# EAGLE board Rocket32_TRASIO_fixed (EAGLE 9.6.2)
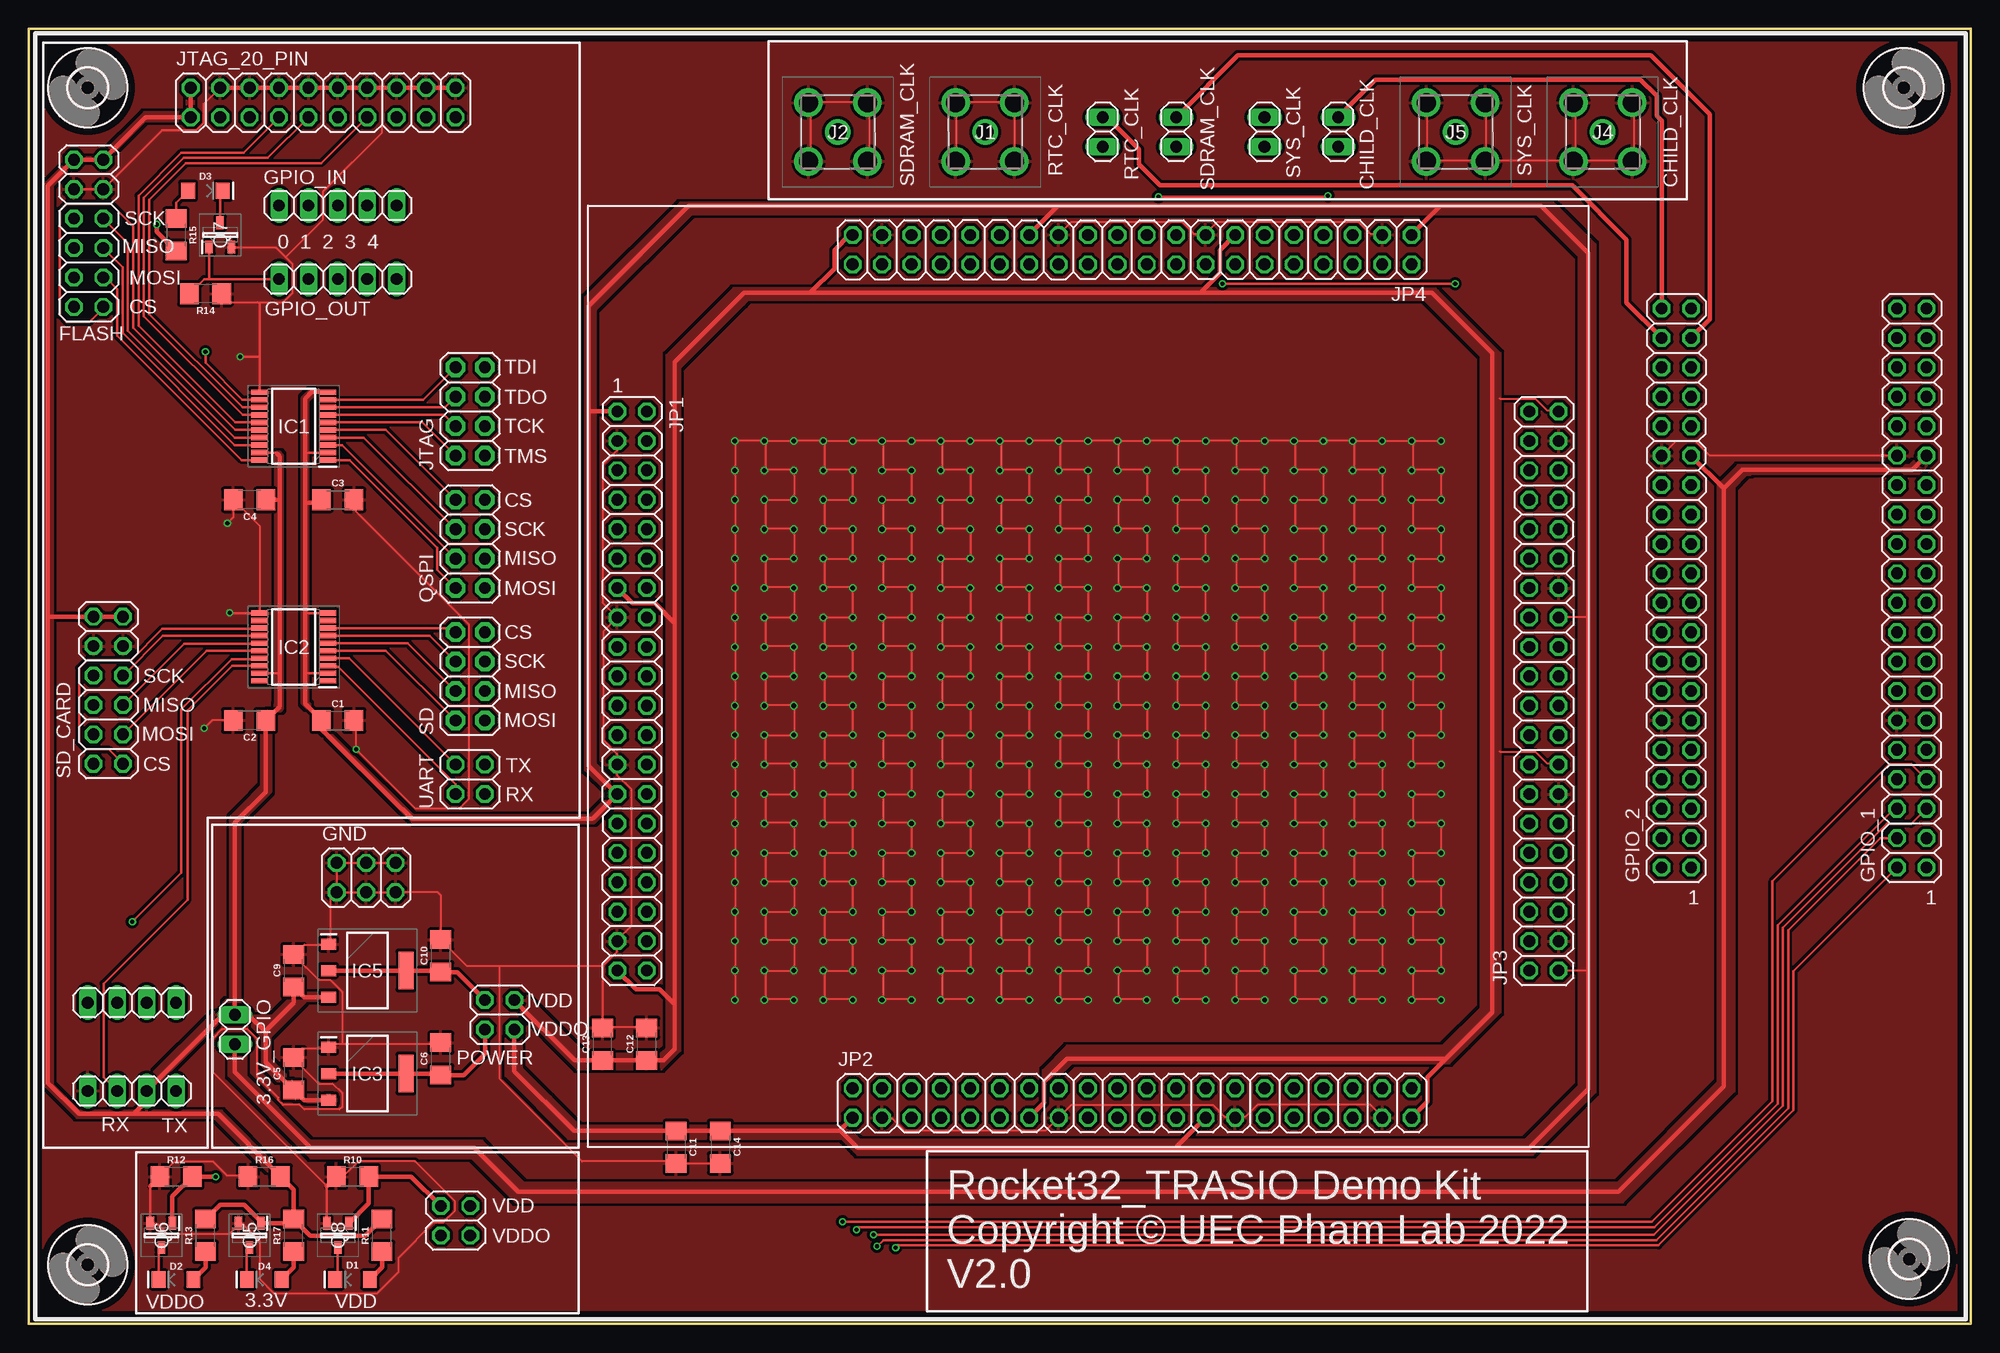
[diagram p2: board, top side]
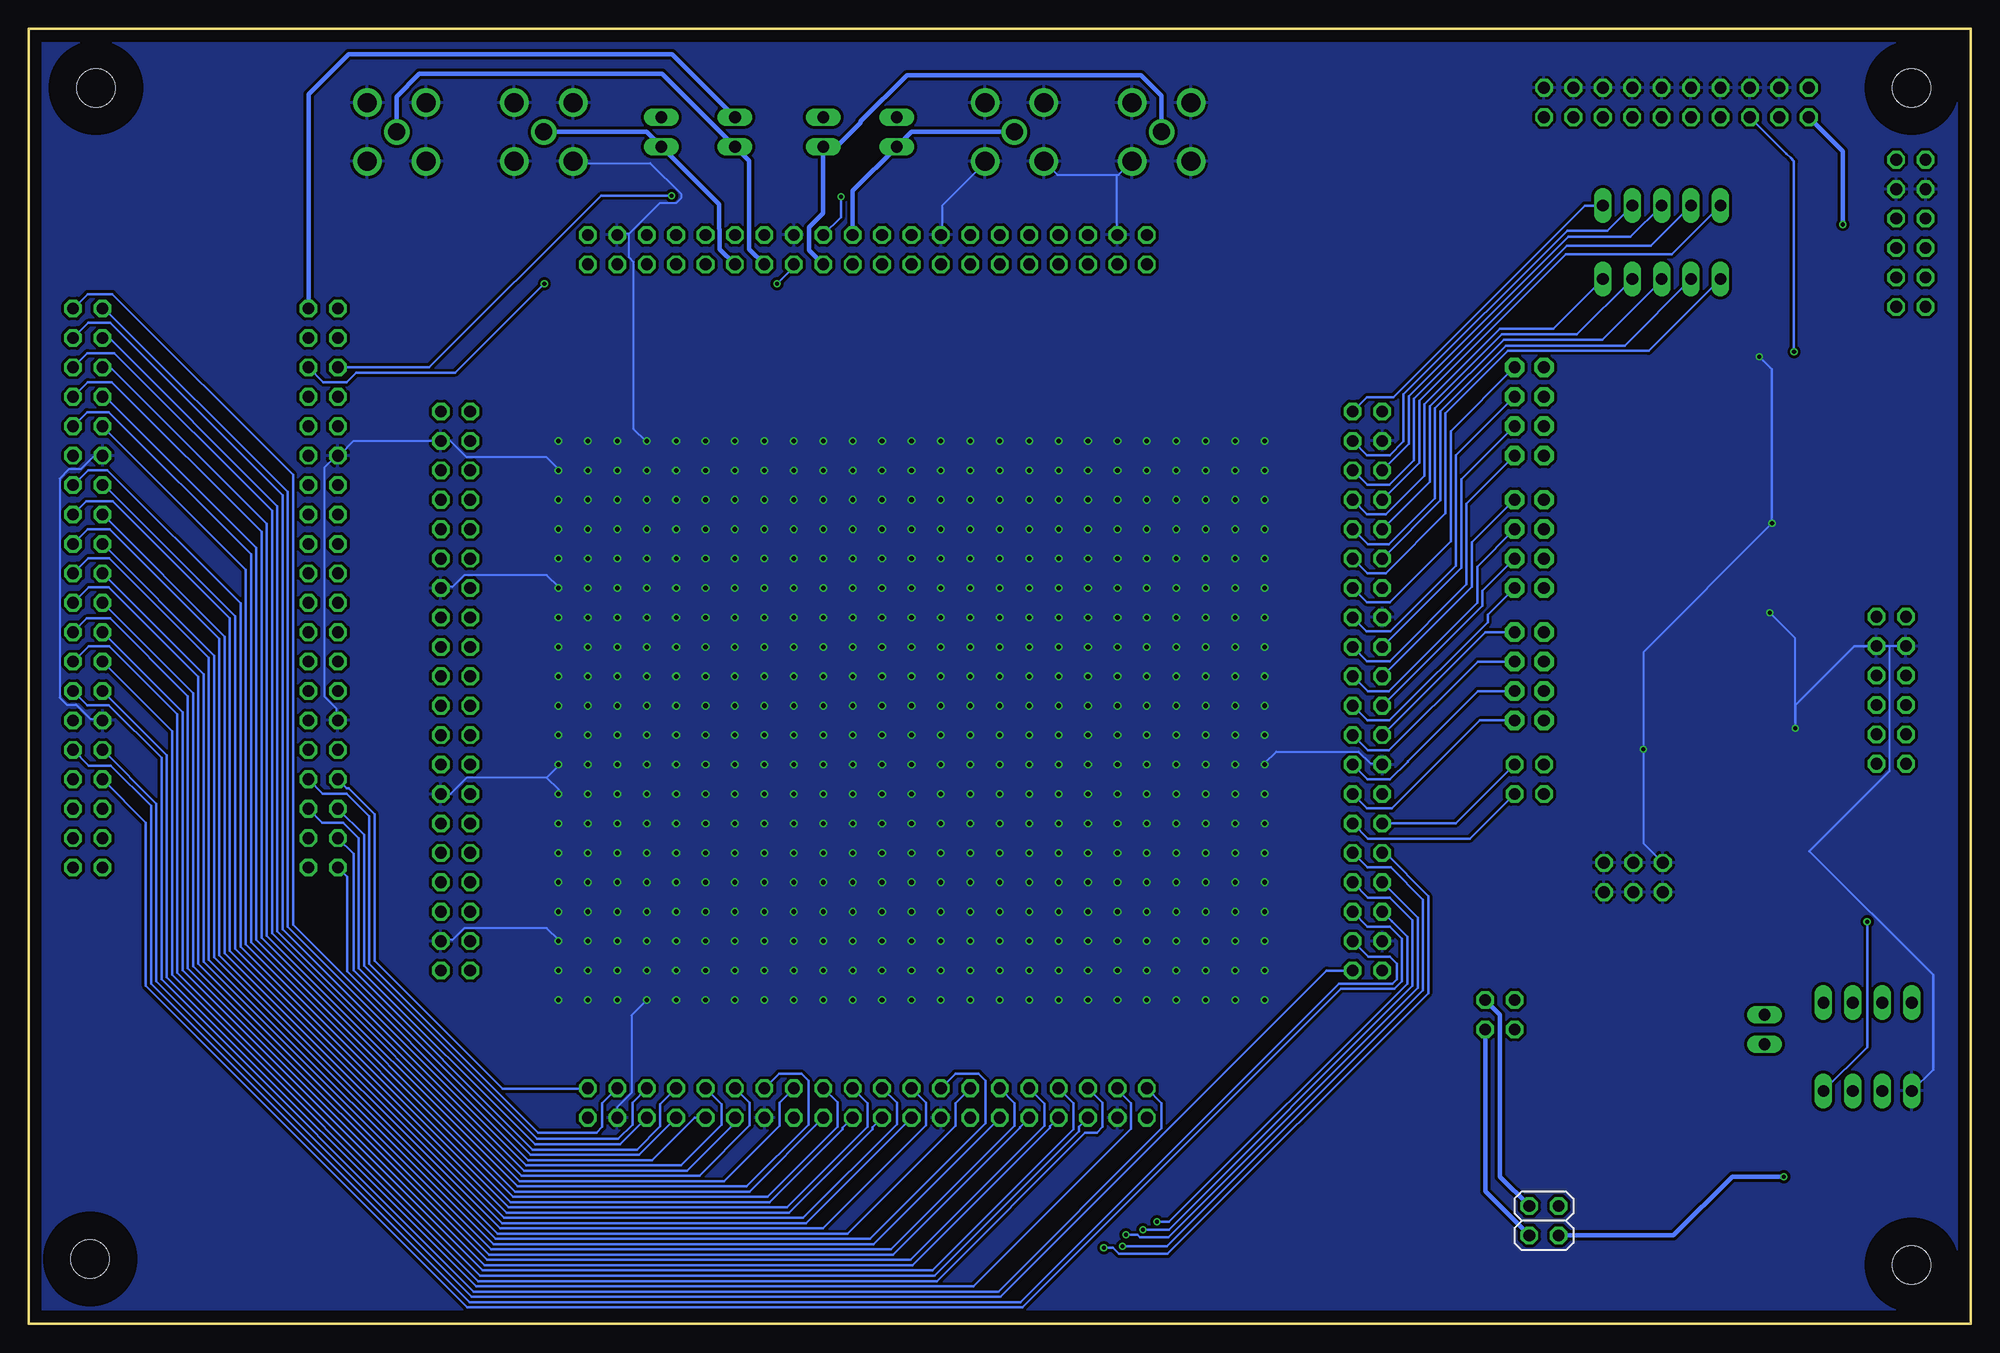
[diagram p3: board, bottom side, seen from below]

Size 167.64 x 111.76 mm. Coordinates in mm from the lower left corner, seen from the top.
Outline: 167.64,111.76 0,111.76 0,0 167.64,0 167.64,111.76
Copper layers (1*16): Top 0.035mm / dielectric 1.5mm / Bottom 0.035mm
Design rules "default *": minimum track width 6mil, minimum drill 0.35mm, track to track 10mil, track to pad 10mil, pad to pad 6mil, via to via 10mil, smd to smd 10mil, copper to edge 40mil, drill to drill 6mil, minimum pad ring 0.13mm, minimum via ring 0.13mm, stop-mask expansion 4mil, vias tented up to drill 0mil, thermal gap 10mil

## Footprints (pad centres in the part's own frame; a part is rotated, then mirrored left to right if it is on the bottom)
1X02 = drill 1.016 long: 1 -1.27,0; 2 1.27,0
1206 = smd 1.6 x 1.8: 1 -1.4,0; 2 1.4,0
LED-1206 = smd 1.2 x 1.4: A -1.5,0; C 1.5,0
2X06 = drill 1.016 octagon: 1 -6.35,-1.27; 2 -6.35,1.27; 3 -3.81,-1.27; 4 -3.81,1.27; 5 -1.27,-1.27; 6 -1.27,1.27; 7 1.27,-1.27; 8 1.27,1.27; 9 3.81,-1.27; 10 3.81,1.27; 11 6.35,-1.27; 12 6.35,1.27
2X03 = drill 1.016 octagon: 1 -2.54,-1.27; 2 -2.54,1.27; 3 0,-1.27; 4 0,1.27; 5 2.54,-1.27; 6 2.54,1.27
2X20 = drill 1.016 octagon: 1 -24.13,-1.27; 2 -24.13,1.27; 3 -21.59,-1.27; 4 -21.59,1.27; 5 -19.05,-1.27; 6 -19.05,1.27; 7 -16.51,-1.27; 8 -16.51,1.27; 9 -13.97,-1.27; 10 -13.97,1.27; 11 -11.43,-1.27; 12 -11.43,1.27; 13 -8.89,-1.27; 14 -8.89,1.27; 15 -6.35,-1.27; 16 -6.35,1.27; 17 -3.81,-1.27; 18 -3.81,1.27; 19 -1.27,-1.27; 20 -1.27,1.27; 21 1.27,-1.27; 22 1.27,1.27; 23 3.81,-1.27; 24 3.81,1.27; 25 6.35,-1.27; 26 6.35,1.27; 27 8.89,-1.27; 28 8.89,1.27; 29 11.43,-1.27; 30 11.43,1.27; 31 13.97,-1.27; 32 13.97,1.27; 33 16.51,-1.27; 34 16.51,1.27; 35 19.05,-1.27; 36 19.05,1.27; 37 21.59,-1.27; 38 21.59,1.27; 39 24.13,-1.27; 40 24.13,1.27
1X05 = drill 1.016 long: 1 -5.08,0; 2 -2.54,0; 3 0,0; 4 2.54,0; 5 5.08,0
3,3 = hole 3.3: 0,0
SOP65P640X120-20N = smd 1.475 x 0.45: 1 -2.938,2.925; 2 -2.938,2.275; 3 -2.938,1.625; 4 -2.938,0.975; 5 -2.938,0.325; 6 -2.938,-0.325; 7 -2.938,-0.975; 8 -2.938,-1.625; 9 -2.938,-2.275; 10 -2.938,-2.925; 11 2.938,-2.925; 12 2.938,-2.275; 13 2.938,-1.625; 14 2.938,-0.975; 15 2.938,-0.325; 16 2.938,0.325; 17 2.938,0.975; 18 2.938,1.625; 19 2.938,2.275; 20 2.938,2.925
SOT229P700X180-4N = smd 1.3 x 0.95: 1 -3.35,2.29; 2 -3.35,0; 3 -3.35,-2.29 | smd 1.3 x 3.25: 4 3.35,0
29856004 = drill 1.64 pad 2.46: 1 0,0; 2 5.08,0; 3 5.08,5.08; 4 0,5.08 | drill 1.47 pad 2.205: 5 2.54,2.54
2X04 = drill 1.016 pad 1.676 octagon: 1 -3.81,-1.27; 2 -3.81,1.27; 3 -1.27,-1.27; 4 -1.27,1.27; 5 1.27,-1.27; 6 1.27,1.27; 7 3.81,-1.27; 8 3.81,1.27
2X10 = drill 1.016 octagon: 1 -11.43,-1.27; 2 -11.43,1.27; 3 -8.89,-1.27; 4 -8.89,1.27; 5 -6.35,-1.27; 6 -6.35,1.27; 7 -3.81,-1.27; 8 -3.81,1.27; 9 -1.27,-1.27; 10 -1.27,1.27; 11 1.27,-1.27; 12 1.27,1.27; 13 3.81,-1.27; 14 3.81,1.27; 15 6.35,-1.27; 16 6.35,1.27; 17 8.89,-1.27; 18 8.89,1.27; 19 11.43,-1.27; 20 11.43,1.27
2X02 = drill 1.016 octagon: 1 -1.27,-1.27; 2 -1.27,1.27; 3 1.27,-1.27; 4 1.27,1.27
SOT96P240X100-3N = smd 1.1 x 0.65: 1 -1.05,0.96; 2 -1.05,-0.96; 3 1.05,0
1X04 = drill 1.016 long: 1 -3.81,0; 2 -1.27,0; 3 1.27,0; 4 3.81,0

## Placement (x,y rotation side)
3.3V_GPIO  [1X02]  17.78,25.4 270 top
C1  0.1uF  [1206]  26.67,52.07 0 top
C2  0.1uF  [1206]  19.05,52.07 180 top
C3  0.1uF  [1206]  26.67,71.12 0 top
C4  0.1uF  [1206]  19.05,71.12 180 top
C5  100uF  [1206]  22.86,21.59 90 top
C6  22uF  [1206]  35.56,22.86 90 top
C9  100uF  [1206]  22.86,30.48 90 top
C10  22uF  [1206]  35.56,31.75 90 top
C11  0.1uF  [1206]  55.88,15.24 270 top
C12  0.1uF  [1206]  53.34,24.13 90 top
C13  10uF  [1206]  49.53,24.13 90 top
C14  10uF  [1206]  59.69,15.24 270 top
CHILD_CLK  [1X02]  113.03,102.87 270 top
D1  [LED-1206]  27.94,3.81 180 top
D2  [LED-1206]  12.7,3.81 180 top
D3  [LED-1206]  15.24,97.79 0 top
D4  [LED-1206]  20.32,3.81 180 top
FLASH  PINHD-2X6  [2X06]  5.15,94.12 270 top
GND  PINHD-2X3  [2X03]  29.11,38.51 0 top
GPIO_1  [2X20]  162.56,63.5 90 top
GPIO_2  [2X20]  142.24,63.5 90 top
GPIO_IN  PINHD-1X5  [1X05]  26.67,96.52 0 top
GPIO_OUT  PINHD-1X5  [1X05]  26.67,90.17 0 top
H1  MOUNT-HOLE3.3  [3,3]  162.36,5.58 0 top
H2  MOUNT-HOLE3.3  [3,3]  161.86,106.68 0 top
H3  MOUNT-HOLE3.3  [3,3]  5.08,106.68 0 top
H4  MOUNT-HOLE3.3  [3,3]  5.08,5.08 0 top
IC1  TXB0108PWR  [SOP65P640X120-20N]  22.86,77.47 180 top
IC2  TXB0108PWR  [SOP65P640X120-20N]  22.86,58.42 180 top
IC3  AMS1117-1.8  [SOT229P700X180-4N]  29.21,21.59 0 top
IC5  AMS1117-1.8  [SOT229P700X180-4N]  29.21,30.48 0 top
J1  2985-6004  [29856004]  80.01,100.33 0 top
J2  2985-6004  [29856004]  67.31,100.33 0 top
J4  2985-6004  [29856004]  133.35,100.33 0 top
J5  2985-6004  [29856004]  120.65,100.33 0 top
JP1  [2X20]  52.07,54.61 270 top
JP2  [2X20]  95.25,19.05 0 top
JP3  [2X20]  130.81,54.61 90 top
JP4  [2X20]  95.25,92.71 180 top
JTAG  [2X04]  38.1,78.74 90 top
JTAG_20_PIN  [2X10]  25.4,105.41 0 top
POWER  [2X02]  40.64,26.67 270 top
POWER_LED  [2X02]  36.83,8.89 270 bottom
Q5  2N7002K-7  [SOT96P240X100-3N]  19.05,7.62 270 top
Q6  2N7002K-7  [SOT96P240X100-3N]  11.43,7.62 270 top
Q7  2N7002K-7  [SOT96P240X100-3N]  16.51,93.98 90 top
Q8  2N7002K-7  [SOT96P240X100-3N]  26.67,7.62 270 top
QSPI  [2X04]  38.1,67.31 90 top
R10  10k  [1206]  27.94,12.7 0 top
R11  330  [1206]  30.48,7.62 90 top
R12  10k  [1206]  12.7,12.7 0 top
R13  330  [1206]  15.24,7.62 90 top
R14  10k  [1206]  15.24,88.9 180 top
R15  330  [1206]  12.7,93.98 270 top
R16  10k  [1206]  20.32,12.7 0 top
R17  330  [1206]  22.86,7.62 90 top
RTC_CLK  [1X02]  92.71,102.87 270 top
SD  [2X04]  38.1,55.88 90 top
SD_CARD  PINHD-2X6  [2X06]  6.85,54.68 270 top
SDRAM_CLK  [1X02]  99.06,102.87 270 top
SYS_CLK  [1X02]  106.68,102.87 270 top
UART  PINHD-2X2  [2X02]  38.1,46.99 90 top
USB-UART_1  PINHD-1X4  [1X04]  8.89,20.09 0 top
USB-UART_2  PINHD-1X4  [1X04]  8.89,27.71 0 top

## Tracks (layer width: path | path; a pad name or v marks a point on that pad's centre or on a via)
CHILDCLOCK
  Bottom 0.406: J5.5 114.3,102.87 CHILD_CLK.2 108.04,96.61 108.04,94.52 108,94.48 108,92.76 JP4.12
CHILDCLOCK_GPIO
  Top 0.406: CHILD_CLK.1 116.27,107.38 139.14,107.38 140.54,105.98 140.54,104.28 140.97,103.85 GPIO_2.40
CLOCK_GPIO
  Bottom 0.406: GPIO_2.39 143.51,106.11 140.04,109.58 112.12,109.58 SYS_CLK.1
CS
  Top 0.2: IC2.13 19.92,59.98 11.51,59.98 8.81,57.28 5.04,57.28 4.34,56.58 4.34,50.18 4.94,49.58 6.87,49.58 SD_CARD.12
EXTSER_IN_BITS[0]
  Bottom 0.2: JP2.28 102.88,21.58 100.94,21.58 100.34,20.98 100.34,17.18 105.66,11.86 125.47,11.86 147.11,33.5 147.11,69.03 160.63,82.55 GPIO_1.36
EXTSER_IN_BITS[1]
  Bottom 0.2: JP2.26 102.84,19.08 102.84,17.08 107.61,12.31 125.28,12.31 146.66,33.69 146.66,70.17 160.26,83.78 162.6,83.78 GPIO_1.35
EXTSER_IN_BITS[2]
  Bottom 0.2: JP2.24 97.84,19.1 97.84,16.98 103.87,10.95 125.84,10.95 148.02,33.12 148.02,66.98 161.05,80.01 GPIO_1.34
EXTSER_IN_BITS[3]
  Bottom 0.2: GPIO_1.33 162.56,81.28 160.5,81.28 147.56,68.34 147.56,33.31 125.66,11.4 105.44,11.4 JP2.23
EXTSER_IN_BITS[4]
  Bottom 0.2: JP2.22 95.24,19.04 95.24,16.98 102.18,10.04 126.22,10.04 148.93,32.75 148.93,65.07 161.29,77.43 GPIO_1.32
EXTSER_IN_BITS[5]
  Bottom 0.2: GPIO_1.31 162.62,78.68 160.74,78.68 148.47,66.41 148.47,32.93 126.03,10.49 103.68,10.49 97.39,16.79 97.39,16.91 JP2.21
EXTSER_IN_BITS[6]
  Bottom 0.2: JP2.20 92.71,19.05 92.71,17.21 100.79,9.13 126.6,9.13 149.83,32.37 149.83,61.08 161.14,72.39 GPIO_1.28
EXTSER_IN_BITS[7]
  Bottom 0.2: GPIO_1.27 162.54,73.68 160.88,73.68 149.38,62.18 149.38,32.56 126.41,9.59 101.99,9.59 94.79,16.79 94.79,16.97 JP2.19
EXTSER_IN_READY
  Bottom 0.2: JP2.17 100.54,8.68 126.78,8.68 150.29,32.18 150.29,60.88 160.39,70.98 162.7,70.98 GPIO_1.25
EXTSER_IN_VALID
  Bottom 0.2: JP2.18 90.17,19.05 90.17,17.15 99.1,8.22 126.97,8.22 150.74,31.99 150.74,59.3 GPIO_1.26
EXTSER_OUT_BITS[0]
  Bottom 0.2: GPIO_2.8 140.19,46.21 140.03,46.21 137.8,43.99 137.8,31.34 126.74,20.28 119.42,20.28 JP2.40
EXTSER_OUT_BITS[1]
  Bottom 0.2: JP2.38 118.14,19.02 118.14,16.98 118.64,16.48 123.66,16.48 138.26,31.08 138.26,43.8 140.22,45.76 142.28,45.76 GPIO_2.7
EXTSER_OUT_BITS[2]
  Bottom 0.2: JP2.36 115.54,19.08 115.54,17.18 116.78,15.94 123.76,15.94 138.71,30.89 138.71,42.19 GPIO_2.6
EXTSER_OUT_BITS[3]
  Bottom 0.2: JP2.35 116.59,15.49 123.95,15.49 139.17,30.7 139.17,41.91 140.52,43.26 142.32,43.26 GPIO_2.5
EXTSER_OUT_BITS[4]
  Bottom 0.2: JP2.34 113.14,18.94 113.14,17.04 115.15,15.03 124.14,15.03 139.62,30.51 139.62,40.56 GPIO_2.4
EXTSER_OUT_BITS[5]
  Bottom 0.2: JP2.33 114.96,14.58 124.34,14.58 140.17,30.41 140.17,38.57 GPIO_2.2
EXTSER_OUT_BITS[6]
  Bottom 0.2: JP2.32 107.84,18.94 107.84,17.18 111.35,13.67 124.72,13.67 145.29,34.25 145.29,71.79 161.13,87.63 GPIO_1.40
EXTSER_OUT_BITS[7]
  Bottom 0.2: JP2.31 110.18,17.78 113.84,14.13 124.53,14.13 144.84,34.44 144.84,73.28 160.44,88.88 162.58,88.88 GPIO_1.39
EXTSER_OUT_READY
  Bottom 0.2: JP2.29 106.68,17.34 110.8,13.22 124.9,13.22 145.75,34.06 145.75,71.51 160.62,86.38 162.54,86.38 GPIO_1.37
EXTSER_OUT_VALID
  Bottom 0.2: JP2.30 105.41,19.05 105.41,17.11 109.76,12.76 125.09,12.76 146.2,33.87 146.2,70.56 160.73,85.09 GPIO_1.38
FLASH_CS
  Top 0.2: IC1.16 17.82,77.15 9,85.97 9,94.72 7.04,96.68 3.24,96.68 2.64,96.08 2.64,87.08 3.24,86.48 5.24,86.48 6.42,87.66 FLASH.12
FLASH_MISO
  Top 0.2: FLASH.8 8.09,91.18 8.09,85.53 17.77,75.84 IC1.18
FLASH_MOSI
  Top 0.2: IC1.20 18.38,74.55 7.64,85.28 7.64,89.28 6.61,90.31 FLASH.10
FLASH_QSPI_CS
  Bottom 0.2: JP1.19 43.06,63.62 43.06,67.43 QSPI.7
FLASH_QSPI_MISO
  Bottom 0.2: JP1.21 42.15,61.99 42.15,63.26 QSPI.3
FLASH_QSPI_MOSI
  Bottom 0.2: JP1.22 52.08,52.08 50.16,52.08 41.69,60.55 41.69,61.18 QSPI.1
FLASH_QSPI_SCK
  Bottom 0.2: JP1.20 52.04,54.58 50.24,54.58 42.6,62.22 42.6,65.35 QSPI.5
FLASH_SCK
  Top 0.2: FLASH.6 8.55,93.26 8.55,85.71 17.77,76.5 IC1.17
GND  (via drill 0.35, 0.4)
  Top 0.152: JP1.3 50.8,75.39 49.58,74.17 49.58,62.18 JP1.15 49.58,59.74 49.58,50.39 50.8,49.17 JP1.25 50.8,47.35 52.02,46.13 52.02,34.34 50.8,33.12 JP1.37 50.8,32.11 49.58,30.89 | 49.58,25.6 53.24,25.6 C12.2 | 49.58,25.6 49.58,30.89 | 49.58,25.6 C13.2 | 40.64,30.89 37.79,30.89 35.56,33.12 C10.2 35.56,36.98 35.3,37.24 GND.5 GND.3 GND.1 | 40.64,30.89 49.58,30.89 | IC2.11 19.91,61.37 19.91,68.89 17.68,71.12 C4.2 17.65,69.59 v17.14,69.08 | 22.15,92.05 22.76,91.44 22.76,89 21.95,88.19 19.74,88.19 17.27,88.19 16.66,88.8 R14.1 | 22.15,92.05 21.34,92.86 17.47,92.86 Q7.2 17.27,93.07 | IC1.11 19.91,80.47 | R16.1 18.9,12.8 17.07,12.8 15.85,14.02 12.6,14.02 11.38,12.8 R12.1 | R10.1 26.62,12.8 27.23,12.8 28.45,14.02 33.32,14.02 36.78,10.57 36.78,9.75 35.76,8.74 34.95,8.74 31.9,5.69 31.9,4.47 30.07,2.64 21.13,2.64 19.91,3.86 19.91,7.11 18.29,8.74 Q5.2 18.08,8.53 17.27,7.72 11.99,7.72 11.18,8.53 10.57,8.53 Q6.2 | 27.03,24.18 26.21,24.18 26.01,23.98 IC3.1 25.81,23.77 23.57,23.77 22.96,23.16 C5.2 22.76,22.96 24.99,20.73 26.21,20.73 27.03,19.91 27.03,18.69 26.82,18.49 23.77,18.49 23.37,18.9 21.95,18.9 21.54,19.3 21.54,19.51 19.71,21.34 19.71,24.59 18.9,25.4 16.66,25.4 15.85,24.59 15.85,21.74 25.6,11.99 25.72,11.88 | 27.03,24.18 35.56,24.18 C6.2 | GND.1 26.01,37.24 26.01,32.92 IC5.1 25.81,32.72 23.77,32.72 22.96,31.9 C9.2 22.96,31.7 24.99,29.67 26.01,29.67 27.03,28.65 27.03,24.18 | C1.2 28.24,52.02 v28.24,49.58 33.32,44.5 37.19,44.5 38,45.31 38,60.35 28.24,70.1 28.24,71.12 C3.2 | 120.7,100.38 120.7,105.26 J5.4 | 125.78,100.38 125.78,105.26 J5.3 | 120.7,100.38 125.58,100.38 J5.2 125.78,100.38
  Top 0.152: 120.7,100.38 J5.1 | 133.5,100.38 133.5,105.26 J4.4 | J4.3 138.58,105.26 138.58,100.38 J4.2 138.38,100.38 133.5,100.38 | 133.5,100.38 J4.1 133.3,100.38 125.78,100.38 | C14.2 59.54,13.82 55.88,13.82 C11.2 55.88,14.02 47.75,14.02 40.64,21.13 40.64,30.89 | JP2.37 116.84,17.88 115.82,18.9 106.07,18.9 105.05,17.88 104.24,17.88 JP2.27 104.04,17.88 103.23,17.88 102.21,18.9 90.02,18.9 JP2.15 87.78,16.66 75.59,16.66 74.57,17.68 73.76,17.68 JP2.3 | J2.1 67.46,100.38 67.46,105.26 J2.4 67.46,105.46 72.34,105.46 J2.3 72.54,105.26 72.54,100.38 J2.2 | J1.1 80.06,100.38 80.06,105.26 J1.4 80.06,105.46 84.94,105.46 J1.3 85.14,105.26 85.14,100.38 J1.2 | 101.6,94.08 100.58,94.08 99.57,95.1 90.02,95.1 JP4.25 | 101.6,94.08 102.62,95.1 114.81,95.1 115.82,94.08 116.84,94.08 JP4.3 | 101.6,94.08 JP4.15 | C2.2 15.83,52.07 v15.14,51.38 | GND.6 GND.4 GND.2 GND.1 | 94.08,30.48 94.08,28.04 | 94.08,28.04 96.52,28.04 v96.52,27.94 | 94.08,28.04 v93.98,27.94 | 94.08,30.48 v96.52,30.48 v96.52,33.02 96.52,33.12 94.08,33.12 | 94.08,30.48 v93.98,30.48 | 94.08,35.56 94.08,33.12 | 94.08,33.12 v93.98,33.02 | 94.08,35.56 v96.52,35.56 v96.52,38.1 96.52,38.2 94.08,38.2 | 94.08,35.56 v93.98,35.56 | 94.08,40.64 94.08,38.2 | 94.08,38.2 v93.98,38.1 | 94.08,40.64 v96.52,40.64 v96.52,43.18 96.52,43.28 94.08,43.28 | 94.08,40.64 v93.98,40.64 | 94.08,45.72 94.08,43.28 | 94.08,43.28 v93.98,43.18 | 94.08,45.72 v96.52,45.72 v96.52,48.26 96.52,48.36 94.08,48.36 | 94.08,45.72 v93.98,45.72 | 94.08,50.8 94.08,48.36 | 94.08,48.36 v93.98,48.26 | 94.08,50.8 v96.52,50.8 v96.52,53.34 96.52,53.44 94.08,53.44 | 94.08,50.8 v93.98,50.8 | 94.08,55.88 94.08,53.44
  Top 0.152: 94.08,53.44 v93.98,53.34 | 94.08,55.88 v96.52,55.88 v96.52,58.42 96.52,58.52 94.08,58.52 | 94.08,55.88 v93.98,55.88 | 94.08,60.96 94.08,58.52 | 94.08,58.52 v93.98,58.42 | 94.08,60.96 v96.52,60.96 v96.52,63.5 96.52,63.6 94.08,63.6 | 94.08,60.96 v93.98,60.96 | 94.08,66.04 94.08,63.6 | 94.08,63.6 v93.98,63.5 | 94.08,66.04 v96.52,66.04 v96.52,68.58 96.52,68.68 94.08,68.68 | 94.08,66.04 v93.98,66.04 | 89,30.48 89,28.04 | 89,28.04 91.44,28.04 v91.44,27.94 | 89,28.04 v88.9,27.94 | 89,30.48 v91.44,30.48 v91.44,33.02 91.44,33.12 89,33.12 | 89,30.48 v88.9,30.48 | 89,35.56 89,33.12 | 89,33.12 v88.9,33.02 | 89,35.56 v91.44,35.56 v91.44,38.1 91.44,38.2 89,38.2 | 89,35.56 v88.9,35.56 | 89,40.64 89,38.2 | 89,38.2 v88.9,38.1 | 89,40.64 v91.44,40.64 v91.44,43.18 91.44,43.28 89,43.28 | 89,40.64 v88.9,40.64 | 89,45.72 89,43.28 | 89,43.28 v88.9,43.18 | 89,45.72 v91.44,45.72 v91.44,48.26 91.44,48.36 89,48.36 | 89,45.72 v88.9,45.72 | 89,50.8 89,48.36 | 89,48.36 v88.9,48.26 | 89,50.8 v91.44,50.8 v91.44,53.34 91.44,53.44 89,53.44 | 89,50.8 v88.9,50.8 | 89,55.88 89,53.44 | 89,53.44 v88.9,53.34 | 89,55.88 v91.44,55.88 v91.44,58.42 91.44,58.52 89,58.52 | 89,55.88 v88.9,55.88 | 89,60.96 89,58.52 | 89,58.52 v88.9,58.42 | 89,60.96 v91.44,60.96 v91.44,63.5 91.44,63.6 89,63.6 | 89,60.96 v88.9,60.96 | 89,66.04 89,63.6 | 89,63.6 v88.9,63.5 | 89,66.04 v91.44,66.04 v91.44,68.58 91.44,68.68 89,68.68 | 89,66.04 v88.9,66.04 | 83.92,30.48 83.92,28.04 | 83.92,28.04 86.36,28.04 v86.36,27.94 | 83.92,28.04 v83.82,27.94 | 83.92,30.48 v86.36,30.48 v86.36,33.02 86.36,33.12 83.92,33.12 | 83.92,30.48 v83.82,30.48 | 83.92,35.56 83.92,33.12 | 83.92,33.12 v83.82,33.02 | 83.92,35.56 v86.36,35.56 v86.36,38.1 86.36,38.2 83.92,38.2
  Top 0.152: 83.92,35.56 v83.82,35.56 | 83.92,40.64 83.92,38.2 | 83.92,38.2 v83.82,38.1 | 83.92,40.64 v86.36,40.64 v86.36,43.18 86.36,43.28 83.92,43.28 | 83.92,40.64 v83.82,40.64 | 83.92,45.72 83.92,43.28 | 83.92,43.28 v83.82,43.18 | 83.92,45.72 v86.36,45.72 v86.36,48.26 86.36,48.36 83.92,48.36 | 83.92,45.72 v83.82,45.72 | 83.92,50.8 83.92,48.36 | 83.92,48.36 v83.82,48.26 | 83.92,50.8 v86.36,50.8 v86.36,53.34 86.36,53.44 83.92,53.44 | 83.92,50.8 v83.82,50.8 | 83.92,55.88 83.92,53.44 | 83.92,53.44 v83.82,53.34 | 83.92,55.88 v86.36,55.88 v86.36,58.42 86.36,58.52 83.92,58.52 | 83.92,55.88 v83.82,55.88 | 83.92,60.96 83.92,58.52 | 83.92,58.52 v83.82,58.42 | 83.92,60.96 v86.36,60.96 v86.36,63.5 86.36,63.6 83.92,63.6 | 83.92,60.96 v83.82,60.96 | 83.92,66.04 83.92,63.6 | 83.92,63.6 v83.82,63.5 | 83.92,66.04 v86.36,66.04 v86.36,68.58 86.36,68.68 83.92,68.68 | 83.92,66.04 v83.82,66.04 | 78.84,30.48 78.84,28.04 | 78.84,28.04 81.28,28.04 v81.28,27.94 | 78.84,28.04 v78.74,27.94 | 78.84,30.48 v81.28,30.48 v81.28,33.02 81.28,33.12 78.84,33.12 | 78.84,30.48 v78.74,30.48 | 78.84,35.56 78.84,33.12 | 78.84,33.12 v78.74,33.02 | 78.84,35.56 v81.28,35.56 v81.28,38.1 81.28,38.2 78.84,38.2 | 78.84,35.56 v78.74,35.56 | 78.84,40.64 78.84,38.2 | 78.84,38.2 v78.74,38.1 | 78.84,40.64 v81.28,40.64 v81.28,43.18 81.28,43.28 78.84,43.28 | 78.84,40.64 v78.74,40.64 | 78.84,45.72 78.84,43.28 | 78.84,43.28 v78.74,43.18 | 78.84,45.72 v81.28,45.72 v81.28,48.26 81.28,48.36 78.84,48.36 | 78.84,45.72 v78.74,45.72 | 78.84,50.8 78.84,48.36 | 78.84,48.36 v78.74,48.26 | 78.84,50.8 v81.28,50.8 v81.28,53.34 81.28,53.44 78.84,53.44 | 78.84,50.8 v78.74,50.8 | 78.84,55.88 78.84,53.44
  Top 0.152: 78.84,53.44 v78.74,53.34 | 78.84,55.88 v81.28,55.88 v81.28,58.42 81.28,58.52 78.84,58.52 | 78.84,55.88 v78.74,55.88 | 78.84,60.96 78.84,58.52 | 78.84,58.52 v78.74,58.42 | 78.84,60.96 v81.28,60.96 v81.28,63.5 81.28,63.6 78.84,63.6 | 78.84,60.96 v78.74,60.96 | 78.84,66.04 78.84,63.6 | 78.84,63.6 v78.74,63.5 | 78.84,66.04 v81.28,66.04 v81.28,68.58 81.28,68.68 78.84,68.68 | 78.84,66.04 v78.74,66.04 | 73.76,30.48 73.76,28.04 | 73.76,28.04 76.2,28.04 v76.2,27.94 | 73.76,28.04 v73.66,27.94 | 73.76,30.48 v76.2,30.48 v76.2,33.02 76.2,33.12 73.76,33.12 | 73.76,30.48 v73.66,30.48 | 73.76,35.56 73.76,33.12 | 73.76,33.12 v73.66,33.02 | 73.76,35.56 v76.2,35.56 v76.2,38.1 76.2,38.2 73.76,38.2 | 73.76,35.56 v73.66,35.56 | 73.76,40.64 73.76,38.2 | 73.76,38.2 v73.66,38.1 | 73.76,40.64 v76.2,40.64 v76.2,43.18 76.2,43.28 73.76,43.28 | 73.76,40.64 v73.66,40.64 | 73.76,45.72 73.76,43.28 | 73.76,43.28 v73.66,43.18 | 73.76,45.72 v76.2,45.72 v76.2,48.26 76.2,48.36 73.76,48.36 | 73.76,45.72 v73.66,45.72 | 73.76,50.8 73.76,48.36 | 73.76,48.36 v73.66,48.26 | 73.76,50.8 v76.2,50.8 v76.2,53.34 76.2,53.44 73.76,53.44 | 73.76,50.8 v73.66,50.8 | 73.76,55.88 73.76,53.44 | 73.76,53.44 v73.66,53.34 | 73.76,55.88 v76.2,55.88 v76.2,58.42 76.2,58.52 73.76,58.52 | 73.76,55.88 v73.66,55.88 | 73.76,60.96 73.76,58.52 | 73.76,58.52 v73.66,58.42 | 73.76,60.96 v76.2,60.96 v76.2,63.5 76.2,63.6 73.76,63.6 | 73.76,60.96 v73.66,60.96 | 73.76,66.04 73.76,63.6 | 73.76,63.6 v73.66,63.5 | 73.76,66.04 v76.2,66.04 v76.2,68.58 76.2,68.68 73.76,68.68 | 73.76,66.04 v73.66,66.04 | 68.68,30.48 68.68,28.04 | 68.68,28.04 71.12,28.04 v71.12,27.94 | 68.68,28.04 v68.58,27.94 | 68.68,30.48 v71.12,30.48 v71.12,33.02 71.12,33.12 68.68,33.12
  Top 0.152: 68.68,30.48 v68.58,30.48 | 68.68,35.56 68.68,33.12 | 68.68,33.12 v68.58,33.02 | 68.68,35.56 v71.12,35.56 v71.12,38.1 71.12,38.2 68.68,38.2 | 68.68,35.56 v68.58,35.56 | 68.68,40.64 68.68,38.2 | 68.68,38.2 v68.58,38.1 | 68.68,40.64 v71.12,40.64 v71.12,43.18 71.12,43.28 68.68,43.28 | 68.68,40.64 v68.58,40.64 | 68.68,45.72 68.68,43.28 | 68.68,43.28 v68.58,43.18 | 68.68,45.72 v71.12,45.72 v71.12,48.26 71.12,48.36 68.68,48.36 | 68.68,45.72 v68.58,45.72 | 68.68,50.8 68.68,48.36 | 68.68,48.36 v68.58,48.26 | 68.68,50.8 v71.12,50.8 v71.12,53.34 71.12,53.44 68.68,53.44 | 68.68,50.8 v68.58,50.8 | 68.68,55.88 68.68,53.44 | 68.68,53.44 v68.58,53.34 | 68.68,55.88 v71.12,55.88 v71.12,58.42 71.12,58.52 68.68,58.52 | 68.68,55.88 v68.58,55.88 | 68.68,60.96 68.68,58.52 | 68.68,58.52 v68.58,58.42 | 68.68,60.96 v71.12,60.96 v71.12,63.5 71.12,63.6 68.68,63.6 | 68.68,60.96 v68.58,60.96 | 68.68,66.04 68.68,63.6 | 68.68,63.6 v68.58,63.5 | 68.68,66.04 v71.12,66.04 v71.12,68.58 71.12,68.68 68.68,68.68 | 68.68,66.04 v68.58,66.04 | 63.6,30.48 63.6,28.04 | 63.6,28.04 66.04,28.04 v66.04,27.94 | 63.6,28.04 v63.5,27.94 | 63.6,30.48 v66.04,30.48 v66.04,33.02 66.04,33.12 63.6,33.12 | 63.6,30.48 v63.5,30.48 | 63.6,35.56 63.6,33.12 | 63.6,33.12 v63.5,33.02 | 63.6,35.56 v66.04,35.56 v66.04,38.1 66.04,38.2 63.6,38.2 | 63.6,35.56 v63.5,35.56 | 63.6,40.64 63.6,38.2 | 63.6,38.2 v63.5,38.1 | 63.6,40.64 v66.04,40.64 v66.04,43.18 66.04,43.28 63.6,43.28 | 63.6,40.64 v63.5,40.64 | 63.6,45.72 63.6,43.28 | 63.6,43.28 v63.5,43.18 | 63.6,45.72 v66.04,45.72 v66.04,48.26 66.04,48.36 63.6,48.36 | 63.6,45.72 v63.5,45.72 | 63.6,50.8 63.6,48.36 | 63.6,48.36 v63.5,48.26 | 63.6,50.8 v66.04,50.8 v66.04,53.34 66.04,53.44 63.6,53.44
  Top 0.152: 63.6,50.8 v63.5,50.8 | 63.6,55.88 63.6,53.44 | 63.6,53.44 v63.5,53.34 | 63.6,55.88 v66.04,55.88 v66.04,58.42 66.04,58.52 63.6,58.52 | 63.6,55.88 v63.5,55.88 | 63.6,60.96 63.6,58.52 | 63.6,58.52 v63.5,58.42 | 63.6,60.96 v66.04,60.96 v66.04,63.5 66.04,63.6 63.6,63.6 | 63.6,60.96 v63.5,60.96 | 63.6,66.04 63.6,63.6 | 63.6,63.6 v63.5,63.5 | 63.6,66.04 v66.04,66.04 v66.04,68.58 66.04,68.68 63.6,68.68 | 63.6,66.04 v63.5,66.04 | v60.96,27.94 v60.96,30.48 v60.96,33.02 v60.96,35.56 v60.96,38.1 v60.96,40.64 v60.96,43.18 v60.96,45.72 v60.96,48.26 v60.96,50.8 v60.96,53.34 v60.96,55.88 v60.96,58.42 v60.96,60.96 v60.96,63.5 v60.96,66.04 v60.96,68.58 v60.96,71.12 v60.96,73.66 v60.96,76.2 v63.5,76.2 63.6,76.2 | 63.6,71.12 63.6,68.68 | 63.6,68.68 v63.5,68.58 | 63.6,71.12 v66.04,71.12 v66.04,73.66 66.04,73.76 63.6,73.76 | 63.6,71.12 v63.5,71.12 | 63.6,76.2 63.6,73.76 | 63.6,73.76 v63.5,73.66 | 63.6,76.2 v66.04,76.2 v68.58,76.2 68.68,76.2 | 68.68,71.12 68.68,68.68 | 68.68,68.68 v68.58,68.58 | 68.68,71.12 v71.12,71.12 v71.12,73.66 71.12,73.76 68.68,73.76 | 68.68,71.12 v68.58,71.12 | 68.68,76.2 68.68,73.76 | 68.68,73.76 v68.58,73.66 | 68.68,76.2 v71.12,76.2 v73.66,76.2 73.76,76.2 | 73.76,71.12 73.76,68.68 | 73.76,68.68 v73.66,68.58 | 73.76,71.12 v76.2,71.12 v76.2,73.66 76.2,73.76 73.76,73.76 | 73.76,71.12 v73.66,71.12 | 73.76,76.2 73.76,73.76 | 73.76,73.76 v73.66,73.66 | 73.76,76.2 v76.2,76.2 v78.74,76.2 78.84,76.2 | 78.84,71.12 78.84,68.68 | 78.84,68.68 v78.74,68.58 | 78.84,71.12 v81.28,71.12 v81.28,73.66 81.28,73.76 78.84,73.76 | 78.84,71.12 v78.74,71.12 | 78.84,76.2 78.84,73.76 | 78.84,73.76 v78.74,73.66 | 78.84,76.2 v81.28,76.2 v83.82,76.2 83.92,76.2
  Top 0.152: 83.92,71.12 83.92,68.68 | 83.92,68.68 v83.82,68.58 | 83.92,71.12 v86.36,71.12 v86.36,73.66 86.36,73.76 83.92,73.76 | 83.92,71.12 v83.82,71.12 | 83.92,76.2 83.92,73.76 | 83.92,73.76 v83.82,73.66 | 83.92,76.2 v86.36,76.2 v88.9,76.2 89,76.2 | 89,71.12 89,68.68 | 89,68.68 v88.9,68.58 | 89,71.12 v91.44,71.12 v91.44,73.66 91.44,73.76 89,73.76 | 89,71.12 v88.9,71.12 | 89,76.2 89,73.76 | 89,73.76 v88.9,73.66 | 89,76.2 v91.44,76.2 v93.98,76.2 94.08,76.2 | 94.08,71.12 94.08,68.68 | 94.08,68.68 v93.98,68.58 | 94.08,71.12 v96.52,71.12 v96.52,73.66 96.52,73.76 94.08,73.76 | 94.08,71.12 v93.98,71.12 | 94.08,76.2 94.08,73.76 | 94.08,73.76 v93.98,73.66 | 94.08,76.2 v96.52,76.2 v99.06,76.2 99.16,76.2 | 119.48,30.48 119.48,28.04 | 119.48,28.04 121.92,28.04 v121.92,27.94 | 119.48,28.04 v119.38,27.94 | 119.48,30.48 v121.92,30.48 v121.92,33.02 121.92,33.12 119.48,33.12 | 119.48,30.48 v119.38,30.48 | 119.48,35.56 119.48,33.12 | 119.48,33.12 v119.38,33.02 | 119.48,35.56 v121.92,35.56 v121.92,38.1 121.92,38.2 119.48,38.2 | 119.48,35.56 v119.38,35.56 | 119.48,40.64 119.48,38.2 | 119.48,38.2 v119.38,38.1 | 119.48,40.64 v121.92,40.64 v121.92,43.18 121.92,43.28 119.48,43.28 | 119.48,40.64 v119.38,40.64 | 119.48,45.72 119.48,43.28 | 119.48,43.28 v119.38,43.18 | 119.48,45.72 v121.92,45.72 | 119.48,45.72 v119.38,45.72 | 119.48,50.8 119.48,48.36 | 119.48,48.36 121.92,48.36 v121.92,48.26 | 119.48,48.36 v119.38,48.26 | 119.48,50.8 v121.92,50.8 v121.92,53.34 121.92,53.44 119.48,53.44 | 119.48,50.8 v119.38,50.8 | 119.48,55.88 119.48,53.44 | 119.48,53.44 v119.38,53.34 | 119.48,55.88 v121.92,55.88 v121.92,58.42 121.92,58.52 119.48,58.52 | 119.48,55.88 v119.38,55.88
  Top 0.152: 114.4,30.48 114.4,28.04 | 114.4,28.04 116.84,28.04 v116.84,27.94 | 114.4,28.04 v114.3,27.94 | 114.4,30.48 v116.84,30.48 v116.84,33.02 116.84,33.12 114.4,33.12 | 114.4,30.48 v114.3,30.48 | 114.4,35.56 114.4,33.12 | 114.4,33.12 v114.3,33.02 | 114.4,35.56 v116.84,35.56 v116.84,38.1 116.84,38.2 114.4,38.2 | 114.4,35.56 v114.3,35.56 | 114.4,40.64 114.4,38.2 | 114.4,38.2 v114.3,38.1 | 114.4,40.64 v116.84,40.64 v116.84,43.18 116.84,43.28 114.4,43.28 | 114.4,40.64 v114.3,40.64 | 114.4,45.72 114.4,43.28 | 114.4,43.28 v114.3,43.18 | 114.4,45.72 v116.84,45.72 v116.84,48.26 116.84,48.36 114.4,48.36 | 114.4,45.72 v114.3,45.72 | 114.4,50.8 114.4,48.36 | 114.4,48.36 v114.3,48.26 | 114.4,50.8 v116.84,50.8 v116.84,53.34 116.84,53.44 114.4,53.44 | 114.4,50.8 v114.3,50.8 | 114.4,55.88 114.4,53.44 | 114.4,53.44 v114.3,53.34 | 114.4,55.88 v116.84,55.88 v116.84,58.42 116.84,58.52 114.4,58.52 | 114.4,55.88 v114.3,55.88 | 114.4,60.96 114.4,58.52 | 114.4,58.52 v114.3,58.42 | 114.4,60.96 v116.84,60.96 v116.84,63.5 116.84,63.6 114.4,63.6 | 114.4,60.96 v114.3,60.96 | 114.4,66.04 114.4,63.6 | 114.4,63.6 v114.3,63.5 | 114.4,66.04 v116.84,66.04 v116.84,68.58 116.84,68.68 114.4,68.68 | 114.4,66.04 v114.3,66.04 | 109.32,30.48 109.32,28.04 | 109.32,28.04 111.76,28.04 v111.76,27.94 | 109.32,28.04 v109.22,27.94 | 109.32,30.48 v111.76,30.48 v111.76,33.02 111.76,33.12 109.32,33.12 | 109.32,30.48 v109.22,30.48 | 109.32,35.56 109.32,33.12 | 109.32,33.12 v109.22,33.02 | 109.32,35.56 v111.76,35.56 v111.76,38.1 111.76,38.2 109.32,38.2 | 109.32,35.56 v109.22,35.56 | 109.32,40.64 109.32,38.2 | 109.32,38.2 v109.22,38.1 | 109.32,40.64 v111.76,40.64 v111.76,43.18 111.76,43.28 109.32,43.28
  Top 0.152: 109.32,40.64 v109.22,40.64 | 109.32,45.72 109.32,43.28 | 109.32,43.28 v109.22,43.18 | 109.32,45.72 v111.76,45.72 v111.76,48.26 111.76,48.36 109.32,48.36 | 109.32,45.72 v109.22,45.72 | 109.32,50.8 109.32,48.36 | 109.32,48.36 v109.22,48.26 | 109.32,50.8 v111.76,50.8 v111.76,53.34 111.76,53.44 109.32,53.44 | 109.32,50.8 v109.22,50.8 | 109.32,55.88 109.32,53.44 | 109.32,53.44 v109.22,53.34 | 109.32,55.88 v111.76,55.88 v111.76,58.42 111.76,58.52 109.32,58.52 | 109.32,55.88 v109.22,55.88 | 109.32,60.96 109.32,58.52 | 109.32,58.52 v109.22,58.42 | 109.32,60.96 v111.76,60.96 v111.76,63.5 111.76,63.6 109.32,63.6 | 109.32,60.96 v109.22,60.96 | 109.32,66.04 109.32,63.6 | 109.32,63.6 v109.22,63.5 | 109.32,66.04 v111.76,66.04 v111.76,68.58 111.76,68.68 109.32,68.68 | 109.32,66.04 v109.22,66.04 | 104.24,30.48 104.24,28.04 | 104.24,28.04 106.68,28.04 v106.68,27.94 | 104.24,28.04 v104.14,27.94 | 104.24,30.48 v106.68,30.48 v106.68,33.02 106.68,33.12 104.24,33.12 | 104.24,30.48 v104.14,30.48 | 104.24,35.56 104.24,33.12 | 104.24,33.12 v104.14,33.02 | 104.24,35.56 v106.68,35.56 v106.68,38.1 106.68,38.2 104.24,38.2 | 104.24,35.56 v104.14,35.56 | 104.24,40.64 104.24,38.2 | 104.24,38.2 v104.14,38.1 | 104.24,40.64 v106.68,40.64 v106.68,43.18 106.68,43.28 104.24,43.28 | 104.24,40.64 v104.14,40.64 | 104.24,45.72 104.24,43.28 | 104.24,43.28 v104.14,43.18 | 104.24,45.72 v106.68,45.72 v106.68,48.26 106.68,48.36 104.24,48.36 | 104.24,45.72 v104.14,45.72 | 104.24,50.8 104.24,48.36 | 104.24,48.36 v104.14,48.26 | 104.24,50.8 v106.68,50.8 v106.68,53.34 106.68,53.44 104.24,53.44 | 104.24,50.8 v104.14,50.8 | 104.24,55.88 104.24,53.44 | 104.24,53.44 v104.14,53.34
  Top 0.152: 104.24,55.88 v106.68,55.88 v106.68,58.42 106.68,58.52 104.24,58.52 | 104.24,55.88 v104.14,55.88 | 104.24,60.96 104.24,58.52 | 104.24,58.52 v104.14,58.42 | 104.24,60.96 v106.68,60.96 v106.68,63.5 106.68,63.6 104.24,63.6 | 104.24,60.96 v104.14,60.96 | 104.24,66.04 104.24,63.6 | 104.24,63.6 v104.14,63.5 | 104.24,66.04 v106.68,66.04 v106.68,68.58 106.68,68.68 104.24,68.68 | 104.24,66.04 v104.14,66.04 | 99.16,30.48 99.16,28.04 | 99.16,28.04 101.6,28.04 v101.6,27.94 | 99.16,28.04 v99.06,27.94 | 99.16,30.48 v101.6,30.48 v101.6,33.02 101.6,33.12 99.16,33.12 | 99.16,30.48 v99.06,30.48 | 99.16,35.56 99.16,33.12 | 99.16,33.12 v99.06,33.02 | 99.16,35.56 v101.6,35.56 v101.6,38.1 101.6,38.2 99.16,38.2 | 99.16,35.56 v99.06,35.56 | 99.16,40.64 99.16,38.2 | 99.16,38.2 v99.06,38.1 | 99.16,40.64 v101.6,40.64 v101.6,43.18 101.6,43.28 99.16,43.28 | 99.16,40.64 v99.06,40.64 | 99.16,45.72 99.16,43.28 | 99.16,43.28 v99.06,43.18 | 99.16,45.72 v101.6,45.72 v101.6,48.26 101.6,48.36 99.16,48.36 | 99.16,45.72 v99.06,45.72 | 99.16,50.8 99.16,48.36 | 99.16,48.36 v99.06,48.26 | 99.16,50.8 v101.6,50.8 v101.6,53.34 101.6,53.44 99.16,53.44 | 99.16,50.8 v99.06,50.8 | 99.16,55.88 99.16,53.44 | 99.16,53.44 v99.06,53.34 | 99.16,55.88 v101.6,55.88 v101.6,58.42 101.6,58.52 99.16,58.52 | 99.16,55.88 v99.06,55.88 | 99.16,60.96 99.16,58.52 | 99.16,58.52 v99.06,58.42 | 99.16,60.96 v101.6,60.96 v101.6,63.5 101.6,63.6 99.16,63.6 | 99.16,60.96 v99.06,60.96 | 99.16,66.04 99.16,63.6 | 99.16,63.6 v99.06,63.5 | 99.16,66.04 v101.6,66.04 v101.6,68.58 101.6,68.68 99.16,68.68 | 99.16,66.04 v99.06,66.04 | 119.48,60.96 119.48,58.52 | 119.48,58.52 v119.38,58.42 | 119.48,60.96 v121.92,60.96 v121.92,63.5 121.92,63.6 119.48,63.6
  Top 0.152: 119.48,60.96 v119.38,60.96 | 119.48,66.04 119.48,63.6 | 119.48,63.6 v119.38,63.5 | 119.48,66.04 v121.92,66.04 v121.92,68.58 121.92,68.68 119.48,68.68 | 119.48,66.04 v119.38,66.04 | 99.16,71.12 99.16,68.68 | 99.16,68.68 v99.06,68.58 | 99.16,71.12 v101.6,71.12 v101.6,73.66 101.6,73.76 99.16,73.76 | 99.16,71.12 v99.06,71.12 | 99.16,76.2 99.16,73.76 | 99.16,73.76 v99.06,73.66 | 99.16,76.2 v101.6,76.2 v104.14,76.2 104.24,76.2 | 104.24,71.12 104.24,68.68 | 104.24,68.68 v104.14,68.58 | 104.24,71.12 v106.68,71.12 v106.68,73.66 106.68,73.76 104.24,73.76 | 104.24,71.12 v104.14,71.12 | 104.24,76.2 104.24,73.76 | 104.24,73.76 v104.14,73.66 | 104.24,76.2 v106.68,76.2 v109.22,76.2 109.32,76.2 | 119.48,71.12 119.48,68.68 | 119.48,68.68 v119.38,68.58 | 119.48,71.12 v121.92,71.12 v121.92,73.66 121.92,73.76 119.48,73.76 | 119.48,71.12 v119.38,71.12 | 119.48,76.2 119.48,73.76 | 119.48,73.76 v119.38,73.66 | 119.48,76.2 v121.92,76.2 | 119.48,76.2 v119.38,76.2 v116.84,76.2 114.4,76.2 | 109.32,71.12 109.32,68.68 | 109.32,68.68 v109.22,68.58 | 109.32,71.12 v111.76,71.12 v111.76,73.66 111.76,73.76 109.32,73.76 | 109.32,71.12 v109.22,71.12 | 109.32,76.2 109.32,73.76 | 109.32,73.76 v109.22,73.66 | 109.32,76.2 v111.76,76.2 v114.3,76.2 114.4,76.2 | 114.4,71.12 114.4,68.68 | 114.4,68.68 v114.3,68.58 | 114.4,71.12 v116.84,71.12 v116.84,73.66 116.84,73.76 114.4,73.76 | 114.4,71.12 v114.3,71.12 | 114.4,76.2 114.4,73.76 | 114.4,73.76 v114.3,73.66 | GPIO_2.30 142.24,76.2 143.87,76.2 145.09,74.98 161.14,74.98 GPIO_1.30 | 24.59,106.68 24.56,106.66 | 30.48,106.68 30.48,102.82 25.4,97.74 25.4,95.3 22.15,92.05
  Top 0.2: IC2.11 17.38,61.34 v17.34,61.38 | R10.1 25.71,11.87 Q8.2 | 10.48,11.88 10.47,11.87 Q6.2 | IC1.11 19.92,83.48 | 19.92,83.48 19.92,88.01 19.74,88.19 | JTAG_20_PIN.4 15.09,105.26 15.09,103.68 14.43,103.02 11.51,103.02 FLASH.4 FLASH.3 | v18.24,83.48 19.92,83.48
  Top 0.406: R12.1 10.48,11.88 | R10.1 25.72,11.88 | JTAG_20_PIN.4 JTAG_20_PIN.6 JTAG_20_PIN.8 JTAG_20_PIN.10 | JTAG_20_PIN.10 24.54,106.68 24.56,106.66 24.64,106.58 | JTAG_20_PIN.10 24.59,106.68 JTAG_20_PIN.12 JTAG_20_PIN.14 30.48,106.68 JTAG_20_PIN.16 JTAG_20_PIN.18 JTAG_20_PIN.20
  Bottom 0.152: GPIO_2.12 141.12,52.12 141.12,53.14 142.14,54.15 142.14,73.86 141.12,74.88 GPIO_2.30 140.82,74.98 139.6,76.2 JP3.37 131.27,76.2 129.84,74.78 122.94,74.78 121.92,73.76 v121.92,73.66 | J2.2 73.56,99.16 73.76,99.16 | JP4.25 88.8,94.08 88.8,96.52 85.14,100.18 J1.2 | 73.76,99.16 78.84,99.16 J1.1 | JP2.37 116.84,18.69 115.62,19.91 115.62,26.62 v114.3,27.94 | SD_CARD.3 7,58.49 | 7,58.49 SD_CARD.4 | v15.14,51.38 15.14,59.18 v17.34,61.38 | GND.2 28.24,41.45 v28.24,49.58 28.24,57.98 v17.14,69.08 17.07,69.09 | 13.91,40.77 7,47.67 7,58.49 | 73.76,99.16 73.76,94.08 JP4.37 | 115.82,94.08 116.84,94.08 JP4.3 | 115.82,94.08 113.18,96.72 111.76,96.72 111.35,97.13 111.35,97.54 114,100.18 120.5,100.18 J5.1 | JP3.3 132.08,33.12 131.06,33.12 130.05,34.14 122.94,34.14 121.92,33.12 v121.92,33.02 | JP3.13 131.27,45.72 129.84,47.14 122.94,47.14 | 122.94,47.14 121.92,48.16 v121.92,48.26 | v121.92,45.72 121.92,46.13 122.94,47.14 | GPIO_1.12 161.34,52.22 162.36,52.22 163.58,53.44 164.39,53.44 165,54.05 165,72.95 164.19,73.76 163.17,73.76 162.15,74.78 161.34,74.78 GPIO_1.30 | JP3.27 132.08,63.6 131.06,63.6 130.05,64.62 122.94,64.62 121.92,63.6 v121.92,63.5 | 115.82,94.08 115.82,92.05 115.42,91.64 115.42,77.22 114.4,76.2 v114.3,76.2 | JP1.25 50.8,48.36 51.82,48.36 52.83,49.38 59.94,49.38 60.96,48.36 v60.96,48.26
  Bottom 0.2: USB-UART_1.1 3.24,21.93 3.24,30.1 13.91,40.77 | v15.14,51.38 15.14,53.38 10.03,58.49 SD_CARD.4 | v17.14,69.08 17.14,82.38 v18.24,83.48
  pour Top (rank 2): 0.44,111.28 167.44,111.28 167.44,0.28 0.44,0.28 0.44,14.88
  pour Bottom (rank 2): 0.54,111.58 167.24,111.58 167.24,0.48 0.44,0.48 0.44,2.58 0.44,111.58
GPIO_IN[0]
  Bottom 0.2: JP1.7 47.6,74.32 47.6,79.66 34.96,92.3 25.81,92.3 GPIO_IN.1
GPIO_IN[1]
  Bottom 0.2: JP1.6 52.08,72.4 50.16,72.4 48.05,74.51 48.05,79.85 34.85,93.05 27.6,93.05 GPIO_IN.2
GPIO_IN[2]
  Bottom 0.2: JP1.5 48.5,75.96 48.5,80.04 34.74,93.81 29.38,93.81 GPIO_IN.3
GPIO_IN[3]
  Bottom 0.2: JP1.4 52.12,74.98 50.14,74.98 48.96,76.16 48.96,80.23 34.82,94.36 31.37,94.36 GPIO_IN.4
GPIO_IN[4]
  Bottom 0.2: GPIO_IN.5 33.31,96.52 49.85,79.98 52.1,79.98 JP1.2
GPIO_OUT[0]
  Top 0.2: GPIO_OUT.1 15.61,90.17 | 15.61,90.17 15.11,90.17 R14.2 | Q7.1 15.55,90.23 15.61,90.17
  Bottom 0.2: JP1.12 52.08,64.78 50.48,64.78 45.33,69.94 45.33,78.59 39.94,83.98 27.78,83.98 GPIO_OUT.1
GPIO_OUT[1]
  Bottom 0.2: JP1.11 45.78,71.06 45.78,78.78 40.13,84.43 29.87,84.43 GPIO_OUT.2
GPIO_OUT[2]
  Bottom 0.2: JP1.10 52.04,67.28 50.2,67.28 46.23,71.25 46.23,79 40.3,84.94 31.8,84.94 26.67,90.07 GPIO_OUT.3
GPIO_OUT[3]
  Bottom 0.2: JP1.9 46.69,72.69 46.69,79.19 40.48,85.39 33.99,85.39 GPIO_OUT.4
GPIO_OUT[4]
  Bottom 0.2: JP1.8 52.1,69.88 50.46,69.88 47.14,73.2 47.14,79.38 40.64,85.88 36.04,85.88 GPIO_OUT.5
JRST_N  (via drill 0.35)
  Top 0.2: v112.14,97.38 112.04,97.28 v97.54,97.28
  Bottom 0.2: v97.54,97.28 97.54,95.5 JP4.17 | GPIO_2.36 133.07,82.55 118.24,97.38 v112.14,97.38
JTAG_TCK
  Bottom 0.2: JP1.17 43.96,65.26 43.96,72.88 JTAG.3
JTAG_TDI
  Bottom 0.2: JP1.14 52.12,62.28 50.14,62.28 44.87,67.55 44.87,77.05 JTAG.7
JTAG_TDO
  Bottom 0.2: JP1.16 52.16,59.78 50.08,59.78 44.42,65.44 44.42,74.96 JTAG.5
JTAG_TMS
  Bottom 0.2: JP1.18 52.1,57.18 50.14,57.18 43.51,63.81 43.51,70.79 JTAG.1
MEMSER_IN_BITS[0]
  Bottom 0.2: JP2.4 73.66,20.2 72.49,19.03 72.49,16.83 86.09,3.23 129.04,3.23 155.74,29.93 155.74,49.06 GPIO_1.14
MEMSER_IN_BITS[1]
  Bottom 0.2: JP2.2 69.84,19.04 69.84,16.88 83.94,2.78 129.23,2.78 156.19,29.74 156.19,48.83 160.74,53.38 162.63,53.38 163.83,54.58 GPIO_1.13
MEMSER_IN_BITS[2]
  Bottom 0.2: GPIO_1.10 156.64,44.88 156.64,29.55 129.42,2.32 83.76,2.32 55.6,30.48 JP1.40
MEMSER_IN_BITS[3]
  Bottom 0.2: JP1.38 52,31.68 50.14,31.68 49.54,31.08 49.54,29.74 49.91,29.36 54.54,29.36 82.04,1.87 129.61,1.87 157.1,29.36 157.1,44.7 160.58,48.18 162.48,48.18 GPIO_1.9
MEMSER_IN_BITS[4]
  Bottom 0.2: JP1.36 52.06,34.28 50.14,34.28 49.09,33.23 49.09,29.55 49.73,28.91 54.36,28.91 81.85,1.41 129.79,1.41 157.55,29.17 157.55,43.25 GPIO_1.8
MEMSER_IN_BITS[5]  (via drill 0.35)
  Top 0.2: v70.24,8.78 140.14,8.78 150.54,19.18 150.54,38.18 160.64,48.28 162.54,48.28 GPIO_1.7
  Bottom 0.2: JP1.35 49.97,34.73 49.95,34.73 48.63,33.41 48.63,29.36 69.21,8.78 v70.24,8.78
MEMSER_IN_BITS[6]  (via drill 0.35)
  Top 0.2: v71.44,8.12 71.64,8.33 140.33,8.33 150.99,18.99 150.99,34.38 161.06,44.45 GPIO_1.6
  Bottom 0.2: JP1.34 52.02,36.78 50.14,36.78 48.18,34.82 48.18,29.17 69.23,8.12 v71.44,8.12
MEMSER_IN_BITS[7]  (via drill 0.35)
  Top 0.2: GPIO_1.5 162.51,43.13 160.39,43.13 151.45,34.19 151.45,18.8 140.31,7.67 v72.94,7.67
  Bottom 0.2: JP1.33 47.72,35.02 47.72,28.99 69.25,7.46 71.71,7.46 71.92,7.67 v72.94,7.67
MEMSER_IN_READY  (via drill 0.35)
  Top 0.2: GPIO_1.2 152.36,30.44 152.36,18.43 140.69,6.76 75.05,6.76 v74.84,6.55
  Bottom 0.2: JP1.31 50.54,40.64 46.82,36.92 46.82,28.54 69.34,6.02 73.51,6.02 74.05,6.55 v74.84,6.55
MEMSER_IN_VALID  (via drill 0.35)
  Top 0.2: v73.24,6.68 73.77,7.21 140.5,7.21 151.9,18.62 151.9,33.98 159.83,41.91 GPIO_1.4
  Bottom 0.2: JP1.32 52.08,39.38 50.04,39.38 47.27,36.61 47.27,28.8 69.39,6.68 v73.24,6.68
MEMSER_OUT_BITS[0]
  Bottom 0.2: JP2.16 87.64,21.58 85.64,21.58 85.04,20.98 85.04,17.28 95,7.32 127.35,7.32 151.65,31.62 151.65,57.67 GPIO_1.24
MEMSER_OUT_BITS[1]
  Bottom 0.2: JP2.14 87.64,19.04 87.64,17.08 96.95,7.77 127.16,7.77 151.2,31.81 151.2,59.11 160.66,68.58 162.56,68.58 GPIO_1.23
MEMSER_OUT_BITS[2]
  Bottom 0.2: JP2.12 82.54,19.04 82.54,17.08 93.21,6.41 127.72,6.41 152.56,31.24 152.56,56.04 GPIO_1.22
MEMSER_OUT_BITS[3]
  Bottom 0.2: JP2.11 94.74,6.86 127.54,6.86 152.1,31.43 152.1,57.48 160.7,66.08 162.52,66.08 GPIO_1.21
MEMSER_OUT_BITS[4]
  Bottom 0.2: JP2.10 79.94,18.98 79.94,17.08 91.52,5.5 128.1,5.5 153.47,30.87 153.47,54.41 GPIO_1.20
MEMSER_OUT_BITS[5]
  Bottom 0.2: JP2.9 82.09,16.97 82.09,16.89 93.02,5.95 127.91,5.95 153.01,31.05 153.01,55.85 160.74,63.58 162.48,63.58 GPIO_1.19
MEMSER_OUT_BITS[6]
  Bottom 0.2: JP2.8 77.44,19.02 77.44,16.78 89.63,4.59 128.48,4.59 154.37,30.49 154.37,52.77 GPIO_1.18
MEMSER_OUT_BITS[7]
  Bottom 0.2: JP2.7 79.49,17.03 79.49,16.89 91.33,5.05 128.29,5.05 153.92,30.68 153.92,54.16 160.64,60.88 162.64,60.88 GPIO_1.17
MEMSER_OUT_READY
  Bottom 0.2: JP2.5 76.99,16.99 76.99,16.59 89.44,4.14 128.66,4.14 154.83,30.3 154.83,52.59 160.72,58.48 162.5,58.48 GPIO_1.15
MEMSER_OUT_VALID
  Bottom 0.2: JP2.6 74.94,19.06 74.94,16.98 75.44,16.48 76.46,16.48 89.25,3.68 128.85,3.68 155.28,30.11 155.28,51.14 GPIO_1.16
MISO
  Top 0.2: IC2.15 19.85,58.67 13.38,58.67 SD_CARD.8
MOSI
  Top 0.2: SD_CARD.10 15.34,58.09 IC2.16
N$1
  Top 0.2: IC1.1 27.68,74.55 35.24,66.99 35.24,65.09 QSPI.2
N$2
  Top 0.2: IC1.3 27.02,75.84 QSPI.4
N$3
  Top 0.2: IC1.4 28.91,76.5 QSPI.6
N$5
  Top 0.2: IC1.5 30.8,77.15 QSPI.8
N$6
  Top 0.2: IC2.3 25.87,56.72 26.68,56.72 36.83,46.58 UART.2
N$7
  Top 0.2: IC2.4 27.64,57.45 UART.4
N$8
  Top 0.2: IC1.9 34.02,79.75 JTAG.8
N$9
  Top 0.2: IC1.8 35.91,79.09 JTAG.6
N$10
  Top 0.2: IC1.7 35.85,78.45 JTAG.4
N$11
  Top 0.2: IC1.6 33.96,77.8 JTAG.2
N$12
  Top 0.2: IC2.5 30.8,58.09 SD.2
N$13
  Top 0.2: IC2.6 32.7,58.75 SD.4
N$14
  Top 0.2: IC2.7 34.59,59.4 SD.6
N$15
  Top 0.2: IC2.8 36.47,60.05 SD.8
N$17
  Top 0.2: Q5.3 18.82,6.34 D4.C
N$18
  Top 0.2: Q6.3 11.2,6.34 D2.C
N$19
  Top 0.2: Q7.3 16.51,97.56 D3.C
N$20
  Top 0.2: Q8.3 26.67,4.04 D1.C
N$26
  Top 0.406: D1.A 30.48,4.85 R11.1
N$44
  Top 0.406: D2.A 15.24,4.85 R13.1
N$56
  Top 0.2: D3.A 12.7,96.75 R15.1
N$58
  Top 0.406: D4.A 22.86,4.85 R17.1
RST_N  (via drill 0.35)
  Top 0.2: v123.14,89.78 v103.04,89.78
  Bottom 0.2: GPIO_2.35 142.22,81.26 140.22,81.26 139.38,82.1 130.82,82.1 v123.14,89.78 | v103.04,89.78 101.6,91.22 JP4.16
RTCCLOCK
  Bottom 0.406: J1.5 91.44,102.87 RTC_CLK.2 96.52,97.79 JP4.19
RTCCLOCK_GPIO
  Top 0.406: RTC_CLK.1 93.08,104.14 95.84,101.38 95.84,100.08 97.64,98.28 133.24,98.28 137.94,93.58 137.94,88.12 GPIO_2.38
RX
  Top 0.2: USB-UART_1.2 6.44,21.27 6.44,29.36 13.69,36.61 13.69,52.93 17.55,56.8 IC2.18
SCLK
  Top 0.2: SD_CARD.6 11.56,59.4 IC2.14
SD_QSPI_CS
  Bottom 0.2: JP1.23 41.91,59.69 SD.7
SD_QSPI_MISO
  Bottom 0.2: JP1.26 52.06,46.98 50.14,46.98 48.59,48.53 48.59,48.57 42.55,54.61 SD.3
SD_QSPI_MOSI
  Bottom 0.2: JP1.28 52.1,44.48 49.94,44.48 42.35,52.07 SD.1
SD_QSPI_SCK
  Bottom 0.2: JP1.24 52.02,49.48 50.22,49.48 42.55,57.15 SD.5
SDRAMCLOCK
  Bottom 0.406: J2.5 69.85,105.99 71.64,107.78 91.84,107.78 95.84,103.78 95.84,103.68 97.92,101.6 SDRAM_CLK.2 99.06,95.86 100.28,94.64 100.28,92.66 JP4.18
SDRAMCLOCK_GPIO
  Top 0.406: GPIO_2.37 145.12,86.7 145.12,104.4 140.04,109.48 104.4,109.48 SDRAM_CLK.1
SYS_CLK
  Bottom 0.406: J4.5 135.89,105.93 133.94,107.88 112.96,107.88 SYS_CLK.2 105.46,100.38 105.46,92.76 JP4.14
TCK
  Top 0.2: JTAG_20_PIN.9 20.62,100.63 13.35,100.63 9.93,97.21 9.93,86.96 18.44,78.45 IC1.14
TDI  (via drill 0.35)
  Top 0.2: IC1.12 18.43,79.75 15.24,82.93 v15.24,83.88
  Bottom 0.2: JTAG_20_PIN.5 15.91,101 15.54,100.63 15.24,100.33 v15.24,83.88
TDO
  Top 0.2: JTAG_20_PIN.13 25.25,100.18 13.54,100.18 10.38,97.02 10.38,87.15 18.44,79.09 IC1.13
TMS
  Top 0.2: JTAG_20_PIN.7 18.54,101.09 13.16,101.09 9.46,97.38 9.46,90.03 9.46,89.48 9.46,86.15 17.81,77.8 IC1.15
TX  (via drill 0.35)
  Top 0.2: v8.94,34.7 13.14,38.91 13.14,53.02 17.49,57.37 19.85,57.37 IC2.17
  Bottom 0.2: v8.94,34.7 8.94,23.86 USB-UART_1.4
UART_RXD
  Bottom 0.2: JP1.30 52.04,41.88 43.21,41.88 UART.1
UART_TXD
  Bottom 0.2: JP1.29 44.45,43.18 UART.3
VDD
  Top 0.152: 127,49.38 130.05,49.38 131.06,48.36 132.08,48.36 JP3.15 | 127,79.86 130.05,79.86 131.06,78.84 132.08,78.84 JP3.39
  Top 0.406: POWER.2 47.12,22.73 C13.1 C12.1 54.79,22.73 55.74,23.68 55.74,27.58 | 55.74,27.58 54.44,28.88 52.4,28.88 JP1.39 | 55.74,27.58 55.74,60.48 | JP1.13 52.12,62.18 54.04,62.18 55.74,60.48 | JP4.13 102.82,92.66 102.82,90.66 101.14,88.98 | 55.74,60.48 55.74,82.98 61.74,88.98 67.44,88.98 | 67.44,88.98 101.14,88.98 | 101.14,88.98 121.14,88.98 126.34,83.78 126.34,26.88 122.34,22.88 | 122.34,22.88 89.64,22.88 87.64,20.88 87.64,19.06 JP2.13 | 122.34,22.88 120.74,21.28 120.74,19.14 JP2.39 | 67.44,88.98 69.54,91.08 69.54,92.68 70.84,93.98 JP4.39
  Bottom 0.406: POWER.2 40.64,26.67 40.64,12.7 POWER_LED.1
  pour Top: 41.84,27.48 47.34,21.98 52.84,21.98 54.64,21.98 56.24,23.58 56.24,82.48 61.74,87.98 62.14,88.38 71.04,88.38 120.44,88.38 125.34,83.48 125.34,27.28 122.04,23.98 89.64,23.98 87.54,21.88 87.54,21.18 87.64,21.08 88.64,21.08 90.04,22.48 122.64,22.48 124.14,23.98 127.04,26.88 127.04,32.08 127.04,83.78 121.64,89.18 121.44,89.38 114.54,89.38 60.84,89.38 55.04,83.58 55.04,79.98 55.04,23.78 54.64,23.38 54.54,23.28 48.04,23.28 42.84,28.48 42.14,28.48 41.84,28.18
VDD_1.8_1
  Top 0.406: IC5.2 IC5.4 35.43,30.48 C10.1 36.96,30.35 POWER.1
VDD_1.8_2
  Top 0.406: IC3.2 IC3.4 35.43,21.59 C6.1 37.52,21.46 39.37,23.31 POWER.3
VDD_3V3  (via drill 0.35)
  Top 0.2: IC1.19 21.33,75.2 21.44,75.08 | IC2.19 21.58,56.15 21.64,56.08
  Top 0.406: IC5.3 23.75,28.19 C9.1 22.86,27.7 20.44,25.28 20.44,25.18 | IC3.3 23.75,19.3 C5.1 22.83,20.19 20.44,22.58 20.44,25.18 | R13.2 16.5,10.28 18.59,10.28 20.01,8.86 Q5.1 22.51,8.67 R17.2 | R11.2 29.04,7.58 24.3,7.58 R17.2 | 3.3V_GPIO.1 17.78,43.22 20.45,45.89 C2.1 21.64,53.26 21.64,56.08 21.64,70.98 | 21.44,75.08 21.64,74.88 21.64,70.98 | C4.1 21.5,71.12 21.64,70.98 | 3.3V_GPIO.1 18.95,26.67 20.44,25.18 | 3.3V_GPIO.1 16.74,26.67 USB-UART_1.3 10.16,19.22 9.04,18.1 | 1.64,61.03 1.64,20.8 4.34,18.1 9.04,18.1 | SD_CARD.2 SD_CARD.1 1.64,61.03 | R17.2 22.86,11.56 R16.2 16.32,18.1 9.04,18.1 | 13.94,104.14 12.34,104.14 11.8,104.14 10.09,104.14 FLASH.2 FLASH.1 1.64,98.23 1.64,61.03 | 13.94,104.14 JTAG_20_PIN.1 | JTAG_20_PIN.2 13.97,104.17 13.94,104.14 | R15.2 11.04,94.24 v11.04,94.88
  Bottom 0.406: v11.04,94.88 11.04,101.21 JTAG_20_PIN.1
  pour Top: 18.54,26.38 20.14,24.78 20.14,22.38 23.34,19.18 26.44,19.18 26.44,19.68 23.84,19.68 20.74,22.78 20.74,24.78 23.94,27.98 26.34,27.98 26.34,28.28 26.14,28.48 23.04,28.48 21.04,26.48 18.54,26.48
  pour Top: 17.44,27.18 17.44,43.68 18.44,44.68 20.14,46.38 20.14,47.18 20.14,52.28 20.84,52.98 21.34,53.48 21.34,55.48 21.34,75.08 21.44,75.18 21.54,75.18 21.64,75.18 21.84,74.98 21.84,74.28 21.84,53.08 20.84,52.08 20.84,45.98 18.14,43.28 18.14,42.78 18.14,27.28 18.04,27.18
  pour Top: 16.54,27.48 9.54,20.48 9.54,19.68 10.14,19.68 12.24,21.78 17.54,27.08 17.74,27.08 18.24,27.58 18.24,27.88 18.14,27.98 17.74,27.98 17.04,27.98
  pour Top: 13.64,106.88 13.64,104.98 13.24,104.58 9.94,104.58 6.04,100.68 3.64,100.68 1.24,98.28 1.24,20.68 1.74,20.18 2.04,20.48 2.04,98.18 4.24,100.38 6.64,100.38 10.04,103.78 13.04,103.78 13.14,103.88 14.04,103.88 14.24,104.08 14.24,106.78 14.14,106.88
  pour Top: 1.24,20.68 4.14,17.78 15.94,17.78 21.14,12.58 21.54,12.58 21.54,13.48 16.64,18.38 4.34,18.38 1.94,20.78 1.94,20.88 1.74,20.68
VDD_3V3_GPIO
  Top 0.406: 3.3V_GPIO.2 17.78,21.74 24.34,15.18 38.44,15.18 42.24,11.38 137.24,11.38 146.34,20.48 146.34,72.1 | 146.34,72.1 GPIO_2.29 | GPIO_1.29 162.61,73.71 147.95,73.71 146.34,72.1
  pour Top: 17.24,24.28 17.24,21.38 24.34,14.28 38.24,14.28 42.04,10.48 137.64,10.48 147.24,20.08 147.24,72.28 146.74,72.78 146.24,72.78 145.84,72.38 145.84,20.88 137.14,12.18 42.74,12.18 39.14,15.78 24.34,15.78 18.74,21.38 18.74,24.18 18.24,24.68 17.64,24.68
  pour Top: 146.14,72.68 147.54,74.08 161.34,74.08 162.34,74.08 162.84,74.58 163.44,75.18 163.54,75.18 164.04,75.18 164.34,74.88 164.34,74.48 163.64,73.78 163.24,73.38 160.64,73.38 148.74,73.38 148.64,73.28 148.34,73.28 147.14,72.08 146.14,72.08
VDD_LED
  Top 0.406: Q8.1 29.34,10.38 R10.2 33.02,12.7 POWER_LED.2
VDDO
  Top 0.152: IC1.10 25.81,80.47 25.8,80.43 | JP3.1 134.52,30.48 134.64,30.46 | JP3.25 134.52,60.96 134.64,60.94
  Top 0.2: IC2.10 23.86,61.34 | IC2.2 23.86,56.15 | IC1.2 25.78,75.18 23.84,75.18
  Top 0.406: 25.8,80.43 24.41,80.43 23.84,79.86 23.84,75.18 23.84,70.86 | 23.84,56.16 23.84,53.5 C1.1 25.27,51.33 32.2,44.4 32.25,44.4 33.07,43.58 48.66,43.58 JP1.27 48.34,48.18 48.34,78.68 | 23.84,56.16 23.84,61.36 | 23.84,61.36 23.84,70.86 | C3.1 25.01,70.86 23.84,70.86 | 23.86,61.34 23.84,61.36 | 23.86,56.15 23.84,56.16 | 69.98,16.64 C14.1 C11.1 47.08,16.64 41.91,21.81 POWER.4 | JP2.25 99,15.18 | 99,15.18 71.54,15.18 70.08,16.64 69.98,16.64 | 99,15.18 129.54,15.18 134.64,20.28 134.64,30.46 134.64,60.94 134.64,92.38 130.54,96.48 121.88,96.48 | JP4.1 121.88,96.48 | 121.88,96.48 88.86,96.48 | 88.86,96.48 JP4.27 | 88.86,96.48 56.94,96.48 48.34,87.88 48.34,78.68 | JP1.1 48.4,78.74 48.34,78.68 | 69.98,16.64 JP2.1
  Bottom 0.406: POWER.4 41.91,11.43 POWER_LED.3
  pour Top: 41.14,25.18 41.14,21.38 46.54,15.98 70.14,15.98 71.24,14.88 71.54,14.58 77.24,14.58 129.84,14.58 135.24,19.98 135.24,93.18 132.04,96.38 131.64,96.78 124.24,96.78 56.24,96.78 48.04,88.58 48.04,47.78 49.94,45.88 50.14,46.08 50.14,46.58 50.14,47.18 48.94,48.38 48.94,87.48 57.24,95.78 130.14,95.78 133.84,92.08 133.84,89.58 133.84,20.58 129.14,15.88 71.74,15.88 71.44,16.18 70.54,17.08 66.14,17.08 47.54,17.08 45.04,19.58 42.54,22.08 42.54,23.88 42.54,25.18 42.14,25.58 41.54,25.58
  pour Top: 50.04,45.38 48.44,43.78 45.84,43.78 33.14,43.78 27.84,49.08 25.64,51.28 25.64,51.88 25.64,51.98 24.04,53.58 24.04,79.68 24.44,80.08 24.44,80.68 23.64,79.88 23.64,79.48 23.64,53.58 24.84,52.38 25.14,52.08 25.14,51.38 33.24,43.28 36.54,43.28 48.74,43.28 49.94,44.48 50.54,45.08 50.54,45.18 50.34,45.38
VDDO_LED  (via drill 0.35)
  Top 0.406: v16.14,12.7 R12.2 12.39,10.99 Q6.1
  Bottom 0.406: POWER_LED.4 25.65,7.62 20.57,12.7 v16.14,12.7

## Text on the board
tNames: RTC_CLK | SYS_CLK | SDRAM_CLK | CHILD_CLK | SCK | MISO | 0 1 2 3 4 | MOSI | CS | TDI | TDO | 1 | TCK | TMS | CS | SCK | MISO | MOSI | CS | SCK | SCK | MISO | MISO | MOSI | MOSI | CS | TX | RX | 1 | 1 | VDD | VDDO | RX | TX | VDD | VDDO | Rocket32_TRASIO Demo Kit / Copyright © UEC Pham Lab 2022 / V2.0 | 3.3V | VDDO | VDD